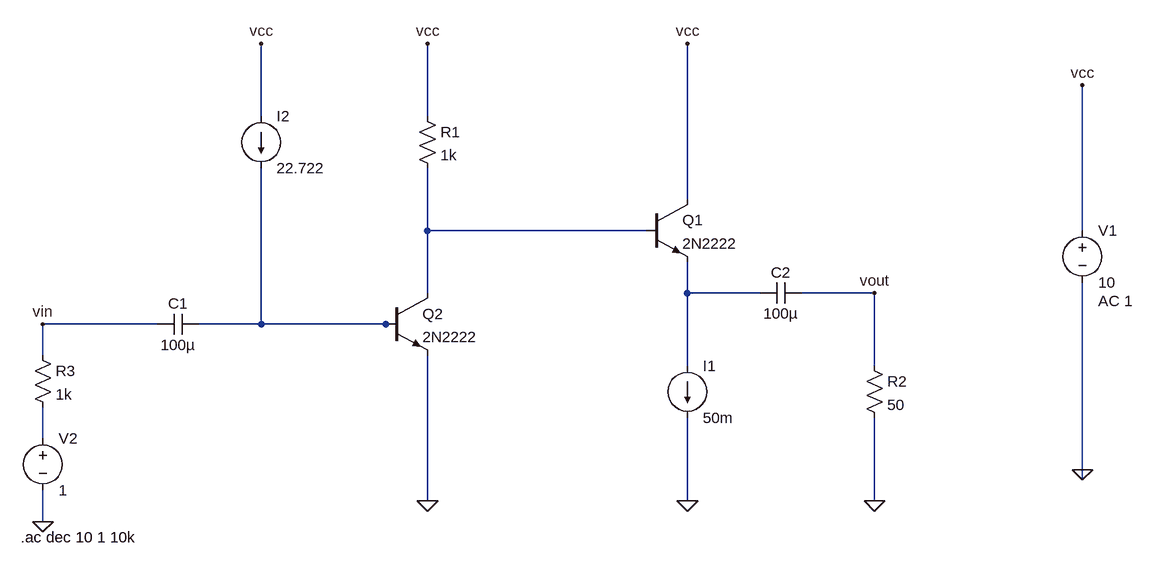
[diagram p0: schematic meros 2o B).asc]
meros 2o B).asc, the LTspice schematic file:
Version 4
SHEET 1 1184 680
WIRE -160 -112 -160 -224
WIRE 96 -112 96 -224
WIRE 496 16 496 -224
WIRE 96 64 96 -32
WIRE 432 64 96 64
WIRE 1104 64 1104 -160
WIRE 96 160 96 64
WIRE 496 160 496 112
WIRE 608 160 496 160
WIRE 784 160 672 160
WIRE -320 208 -496 208
WIRE -160 208 -160 -32
WIRE -160 208 -256 208
WIRE 32 208 -160 208
WIRE 48 208 32 208
WIRE -496 256 -496 208
WIRE 496 272 496 160
WIRE 784 272 784 160
WIRE -496 384 -496 336
WIRE 1104 432 1104 144
WIRE 1104 448 1104 432
WIRE 96 480 96 256
WIRE 496 480 496 352
WIRE 784 480 784 352
WIRE -496 512 -496 464
FLAG 496 480 0
FLAG 784 480 0
FLAG -496 512 0
FLAG 1104 432 0
FLAG 96 -224 vcc
FLAG 496 -224 vcc
FLAG -160 -224 vcc
FLAG 1104 -160 vcc
FLAG 96 480 0
FLAG 784 160 vout
FLAG -496 208 vin
SYMBOL npn 432 16 R0
SYMATTR InstName Q1
SYMATTR Value 2N2222
SYMBOL npn 32 160 R0
SYMATTR InstName Q2
SYMATTR Value 2N2222
SYMBOL res 80 -128 R0
SYMATTR InstName R1
SYMATTR Value 1k
SYMBOL res 768 256 R0
SYMATTR InstName R2
SYMATTR Value 50
SYMBOL res -512 240 R0
SYMATTR InstName R3
SYMATTR Value 1k
SYMBOL cap -256 192 R90
WINDOW 0 0 32 VBottom 2
WINDOW 3 32 32 VTop 2
SYMATTR InstName C1
SYMATTR Value 100µ
SYMBOL cap 672 144 R90
WINDOW 0 0 32 VBottom 2
WINDOW 3 32 32 VTop 2
SYMATTR InstName C2
SYMATTR Value 100µ
SYMBOL current 496 272 R0
WINDOW 123 0 0 Left 0
WINDOW 39 0 0 Left 0
SYMATTR InstName I1
SYMATTR Value 50m
SYMBOL current -160 -112 R0
WINDOW 123 0 0 Left 0
WINDOW 39 0 0 Left 0
SYMATTR InstName I2
SYMATTR Value 22.722
SYMBOL voltage 1104 48 R0
WINDOW 123 24 124 Left 2
WINDOW 39 0 0 Left 0
SYMATTR Value2 AC 1
SYMATTR InstName V1
SYMATTR Value 10
SYMBOL voltage -496 368 R0
WINDOW 123 0 0 Left 0
WINDOW 39 0 0 Left 0
SYMATTR InstName V2
SYMATTR Value 1
TEXT -530 536 Left 2 !.ac dec 10 1 10k

The netlist it stands for:
* meros 2o B).asc
Q1 vcc N001 N002 0 2N2222
Q2 N001 N003 0 0 2N2222
R1 vcc N001 1k
R2 vout 0 50
R3 vin N004 1k
C1 N003 vin 100µ
C2 vout N002 100µ
I1 N002 0 50m
I2 vcc N003 22.722
V1 vcc 0 10 AC 1
V2 N004 0 1
.model NPN NPN
.model PNP PNP
.lib standard.bjt
.ac dec 10 1 10k
.backanno
.end